# Altium schematic sheet CONN.SchDoc
size A4; SheetNumber: 6; SheetTotal: 7
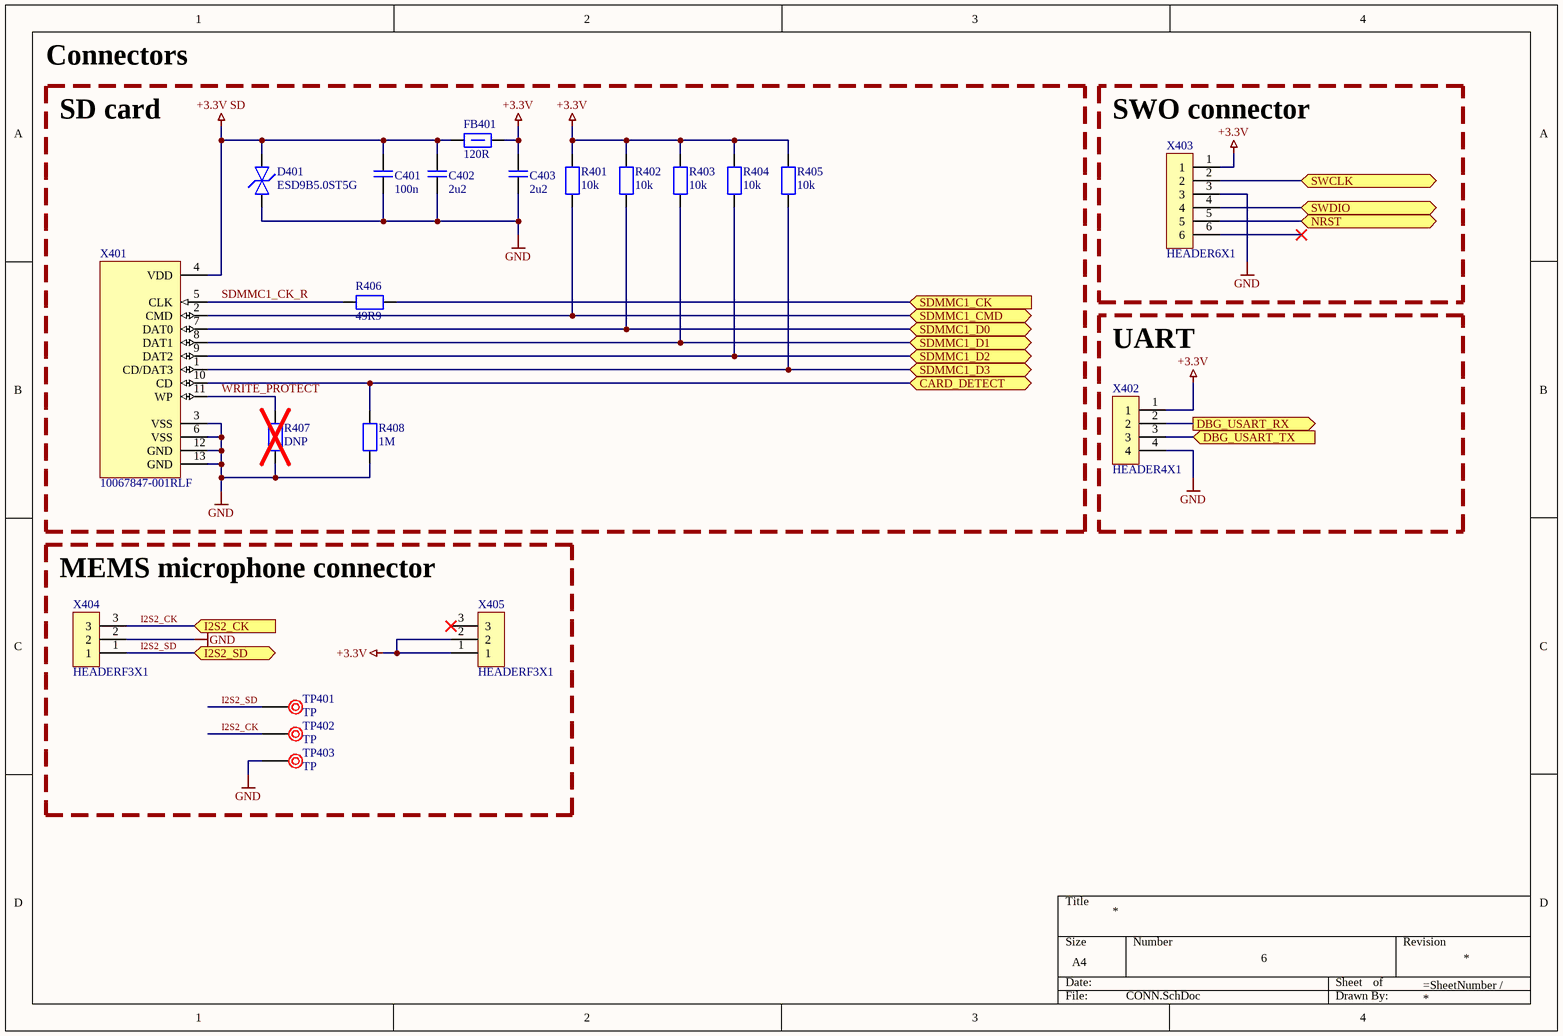
[diagram p0: CONN.SchDoc]

## Parts
C401  100n  [CAPC0603]
C402  2u2  [CAPC0603]
C403  2u2  [CAPC0603]
D401  ESD9B5.0ST5G  [DIOC8060X37]
FB401  120R  [FBC0603]
R401  10k  [RESC0603]
R402  10k  [RESC0603]
R403  10k  [RESC0603]
R404  10k  [RESC0603]
R405  10k  [RESC0603]
R406  49R9  [RESC0603]
R407  DNP  [RESC0603]
R408  1M  [RESC0603]
TP401  TP  [TESTPOINT]
TP402  TP  [TESTPOINT]
TP403  TP  [TESTPOINT]
X401  10067847-001RLF  [SD_10067847-001RLF]
X402  HEADER4X1  [HDRV4W64P254_4X1_1016X254X1150]
X403  HEADER6X1  [HDR6W64P254_6X1_1524X254X1150]
X404  HEADERF3X1  [HDRVF3W64P254_1X3_813X254X850P]
X405  HEADERF3X1  [HDRVF3W64P254_1X3_813X254X850P]

## Blocks framed on the sheet
SWO connector: X403
UART: X402
MEMS microphone connector: TP401-TP403 X404 X405

## Ports
CARD_DETECT (bidir, see MCU[1B]), DBG_USART_RX (out, see MCU[1A]), DBG_USART_TX (in, see MCU[1A]), I2S2_CK (in, see MCU[1C]), I2S2_SD (bidir, see MCU[1C]), NRST (bidir, see MCU[2D], WIRELESS[1B]), SDMMC1_CK (in, see MCU[1D]), SDMMC1_CMD (bidir, see MCU[2A]), SDMMC1_D0 (bidir, see MCU[1D]), SDMMC1_D1 (bidir, see MCU[1D]), SDMMC1_D2 (bidir, see MCU[1D]), SDMMC1_D3 (bidir, see MCU[1D]), SWCLK (bidir, see MCU[1B]), SWDIO (bidir, see MCU[1B])

## Nets
+3.3V: C403.2 FB401.2 R401.2 R402.2 R403.2 R404.2 R405.2 X402.1 X403.1 X405.1 X405.2
+3.3V SD: C401.2 C402.2 D401.2 FB401.1 X401.4(VDD)
GND: C401.1 C402.1 C403.1 D401.1 R407.1 R408.1 TP403.1 X401.3(VSS) X401.6(VSS) X401.12(GND) X401.13(GND) X402.4 X403.3 X404.2
CARD_DETECT: R408.2 X401.10(CD) ; port CARD_DETECT
DBG_USART_RX: X402.2 ; port DBG_USART_RX
DBG_USART_TX: X402.3 ; port DBG_USART_TX
I2S2_CK: TP402.1 X404.3 ; port I2S2_CK
I2S2_SD: TP401.1 X404.1 ; port I2S2_SD
NRST: X403.5 ; port NRST
SDMMC1_CK: R406.1 ; port SDMMC1_CK
SDMMC1_CK_R: R406.2 X401.5(CLK)
SDMMC1_CMD: R401.1 X401.2(CMD) ; port SDMMC1_CMD
SDMMC1_D0: R402.1 X401.7(DAT0) ; port SDMMC1_D0
SDMMC1_D1: R403.1 X401.8(DAT1) ; port SDMMC1_D1
SDMMC1_D2: R404.1 X401.9(DAT2) ; port SDMMC1_D2
SDMMC1_D3: R405.1 X401.1(CD/DAT3) ; port SDMMC1_D3
SWCLK: X403.2 ; port SWCLK
SWDIO: X403.4 ; port SWDIO
WRITE_PROTECT: R407.2 X401.11(WP)

Not connected (* = marked no-connect by the designer): X403 6*; X405 3*

## Notes on the sheet
- Connectors
- SD card

## Library data of the parts
C401-C403 = CAPC0603: Ceramic capacitor, VAL?,  VOL?, DIEL?; Checked: Yes; MFR: ?; Supplier: Digi-Key; SPN: ?; MFRN: ?; LCSC Part Number: ?
  C401: Value: 100n
  C402 C403: Value: 2u2
D401 = TVS DIODE ESD9B5.0ST5G: TVS ZENER DIODE 5VWM; MFR: onsemi; SPN: ESD9B5.0ST5GOSTR-ND; Checked: Yes; Supplier: Digi-Key; MFRN: ESD9B5.0ST5G; Value: ESD9B5.0ST5G; LCSC Part Number: C3021104
FB401 = FB0603-120R: Ferrite bead, 120R@100MHz; MFR: TDK Corporation; MFRN: MMZ1608D121CTDH5; SPN: 445-MMZ1608D121CTDH5TR-ND; Checked: Yes; Supplier: Digi-Key; Value: 120R; LCSC Part Number: C3716437
R401-R408 = RES0603: Thick film resistor, VAL?, POW?; Checked: Yes; MFR: ?; Supplier: Digi-Key; SPN: ?; MFRN: ?; LCSC Part Number: ?
  R401-R405: Value: 10k
  R406: Value: 49R9
  R407: Value: DNP
  R408: Value: 1M
TP401-TP403 = TESTPOINT: MFR: Keystone; MFRN: 5001; SPN: 36-5001-ND; Value: 5001; Checked: Yes; Supplier: Digi-Key; LCSC Part Number: C238122
X401 = CONN SD CARD 10067847-001RLF: SD card connector, push-push, SMD; MFR: Amphenol ICC (FCI); SPN: 609-3956-2-ND; Checked: Yes; Supplier: Digi-Key; MFRN: 10067847-001RLF; Value: 10067847-001RLF; LCSC Part Number: C569097
X402 = HEADER4X1: Pin Header 4x1, P2.54; MFR: Würth Elektronik; MFRN: 61300411121; SPN: 732-5317-ND; Checked: Yes; Supplier: Digi-Key; Value: HEADER4X1
X403 = HEADER6X1: Pin header, 6x1, 100mil pitch; MFR: Adam Tech; MFRN: PH1-06-UA; SPN: 2057-PH1-06-UA-ND; Checked: Yes; Footprint: HEADER6X1; Supplier: Digi-Key; Value: HEADER6X1; LCSC Part Number: C2935912
X404 X405 = HEADERF3X1: Pin Header Female 3x1, P2.54; MFR: Sullins Connector Solutions; MFRN: PPTC031LFBN-RC; SPN: S7001-ND; Checked: Yes; Footprint: HEADERF3X1; Supplier: Digi-Key; Value: HEADERF3X1; LCSC Part Number: *